# EAGLE design main (EAGLE 9.6.2)
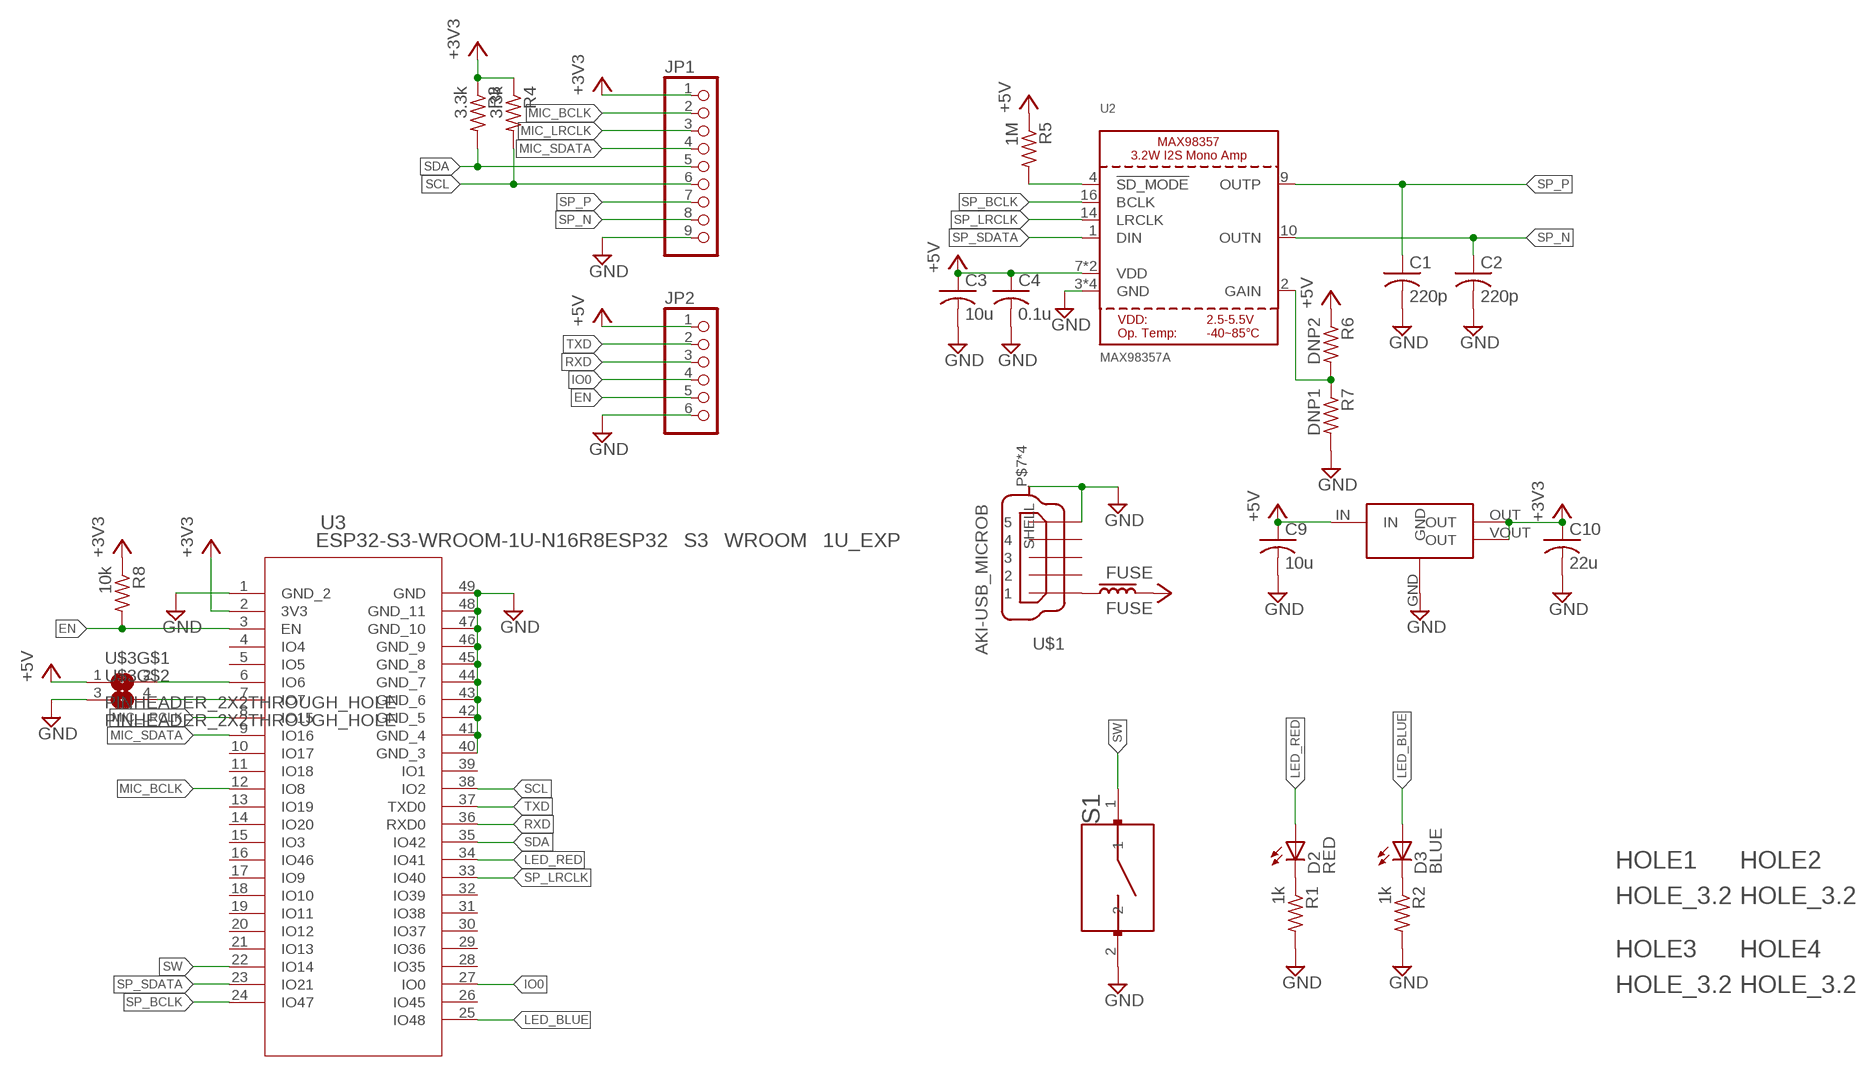
[diagram p0: schematic, sheet 1]

## Parts
C1  220p  C-2012  [2012-C]
C2  220p  C-2012  [2012-C]
C3  10u  C-2012  [2012-C]
C4  0.1u  C-2012  [2012-C]
C9  10u  C-2012  [2012-C]
C10  22u  C-2012  [2012-C]
D2  RED  LED-SMD2012  [D2012]
D3  BLUE  LED-SMD2012  [D2012]
FUSE  FUSE  FB-2012  [2012-C]
HOLE1  HOLE_3.2  [HOLE_3.2]
HOLE2  HOLE_3.2  [HOLE_3.2]
HOLE3  HOLE_3.2  [HOLE_3.2]
HOLE4  HOLE_3.2  [HOLE_3.2]
IC2  AZ1117H-ADJ  [SOT223]
JP1  PINHD-1X9  [1X09]
JP2  PINHD-1X6  [1X06]
R1  1k  R-2012  [2012-R]
R2  1k  R-2012  [2012-R]
R3  3.3k  R-2012  [2012-R]
R4  3.3k  R-2012  [2012-R]
R5  1M  R-2012  [2012-R]
R6  DNP2  R-2012  [2012-R]
R7  DNP1  R-2012  [2012-R]
R8  10k  R-2012  [2012-R]
S1  TACTSW_SMD  [SW_B3U-1000P]
U2  MAX98357A  AUDIOAMP_MAX98357  [QFN16_3MM]
U3  ESP32-S3-WROOM-1U-N16R8ESP32�S3�WROOM�1U_EXP  [ESP32�S3�WROOM�1U_EXP]
U$1  AKI-USB_MICROB  [ZX62R_B]
U$3  PINHEADER_2X2THROUGH_HOLE  [2X02]

## Nets
+3V3: C10.1 IC2.OUT IC2.VOUT(OUT) JP1.1 R3.1 R4.1 R8.1 U3.2(3V3)
+5V: C3.1 C4.1 C9.1 FUSE.2 IC2.IN JP2.1 R5.1 R6.1 U2.7(VDD) U2.8(VDD) U$3.1
EN: JP2.5 R8.2 U3.3(EN)
GND: C1.2 C2.2 C3.2 C4.2 C9.2 C10.2 IC2.GND JP1.9 JP2.6 R1.2 R2.2 R7.2 S1.2 U2.3(GND) U2.11(GND) U2.15(GND) U2.THERMAL(GND) U3.1(GND_2) U3.40(GND_3) U3.41(GND_4) U3.42(GND_5) U3.43(GND_6) U3.44(GND_7) U3.45(GND_8) U3.46(GND_9) U3.47(GND_10) U3.48(GND_11) U3.49(GND) U$1.5 U$1.P$7(SHELL) U$1.P$8(SHELL) U$1.P$9(SHELL) U$1.SH(SHELL) U$3.3
IO0: JP2.4 U3.27(IO0)
LED_BLUE: D3.A U3.25(IO48)
LED_RED: D2.A U3.34(IO41)
MIC_BCLK: JP1.2 U3.12(IO8)
MIC_LRCLK: JP1.3 U3.8(IO15)
MIC_SDATA: JP1.4 U3.9(IO16)
N$1: D3.K R2.1
N$2: FUSE.1 U$1.1
N$3: D2.K R1.1
N$4: R6.2 R7.1 U2.2(GAIN)
N$7: U3.6(IO6) U$3.2
N$9: R5.2 U2.4(!SD_MODE)
N$11: U3.7(IO7) U$3.4
RXD: JP2.3 U3.36(RXD0)
SCL: JP1.6 R4.2 U3.38(IO2)
SDA: JP1.5 R3.2 U3.35(IO42)
SP_BCLK: U2.16(BCLK) U3.24(IO47)
SP_LRCLK: U2.14(LRCLK) U3.33(IO40)
SP_N: C2.1 JP1.8 U2.10(OUTN)
SP_P: C1.1 JP1.7 U2.9(OUTP)
SP_SDATA: U2.1(DIN) U3.23(IO21)
SW: S1.1 U3.22(IO14)
TXD: JP2.2 U3.37(TXD0)
Unconnected: U3.4(IO4) U3.5(IO5) U3.10(IO17) U3.11(IO18) U3.13(IO19) U3.14(IO20) U3.15(IO3) U3.16(IO46) U3.17(IO9) U3.18(IO10) U3.19(IO11) U3.20(IO12) U3.21(IO13) U3.26(IO45) U3.28(IO35) U3.29(IO36) U3.30(IO37) U3.31(IO38) U3.32(IO39) U3.39(IO1) U$1.2 U$1.3 U$1.4

## Library data of the parts
C1-C4 C9 C10 = Passive_Robotech:C
D2 D3 = Diode_Robotech:LED
FUSE = Passive_Robotech:FB
HOLE1-HOLE4 = Document_Robotech:HOLE_3.2: Robotech hole diameter 3.2mm tDoc washer(diameter 8mm) bDoc spacer(diameter 6mm)
IC2 = IC_Robotech:AZ1117H-ADJ: VOLTAGE REGULATOR
JP1 = pinhead:PINHD-1X9: PIN HEADER
JP2 = pinhead:PINHD-1X6: PIN HEADER
R1-R8 = Passive_Robotech:R
S1 = Passive_Robotech:TACTSW_SMD: Ultra-small Surface-mounting Tactile Switches with High Contact Reliability; DESCRIPTION: Switch Tactile N.O. SPST Projected Plunger PC Pins 0.05A 24VDC 1.47N Thru-Hole Bag; DIGI-KEY_PART_NUMBER: SW1021CT-ND; DIGI-KEY_PURCHASE_URL: https://www.digikey.jp/product-detail/en/omron-electronics-inc-emc-div/B3U-1100P/SW1021CT-ND/1534358?utm_source=snapeda&utm_medium=aggregator&utm_campaign=symbol; MF: Omron; MP: B3U-1100P; PACKAGE: None
U2 = microbuilder:AUDIOAMP_MAX98357: MAX98357 - 3.2W I2S Mono Audio Amp
U3 = 2023-11-13_09-10-41_Library:ESP32-S3-WROOM-1U-N16R8; COPYRIGHT: Copyright (C) 2023 Ultra Librarian. All rights reserved.; MANUFACTURER_PART_NUMBER: ESP32-S3-WROOM-1U-N16R8; MFR_NAME: Espressif Systems
U$1 = Connector_Robotech:AKI-USB_MICROB: @秋月 表面実装用ＵＳＢコネクタ・マイクロＢ（ｍｉｃｒｏＢ）（５個入） [ZX62R-B-5P] 通販コード C-05254
U$3 = Connector_Robotech:PINHEADER_2X2

## Board
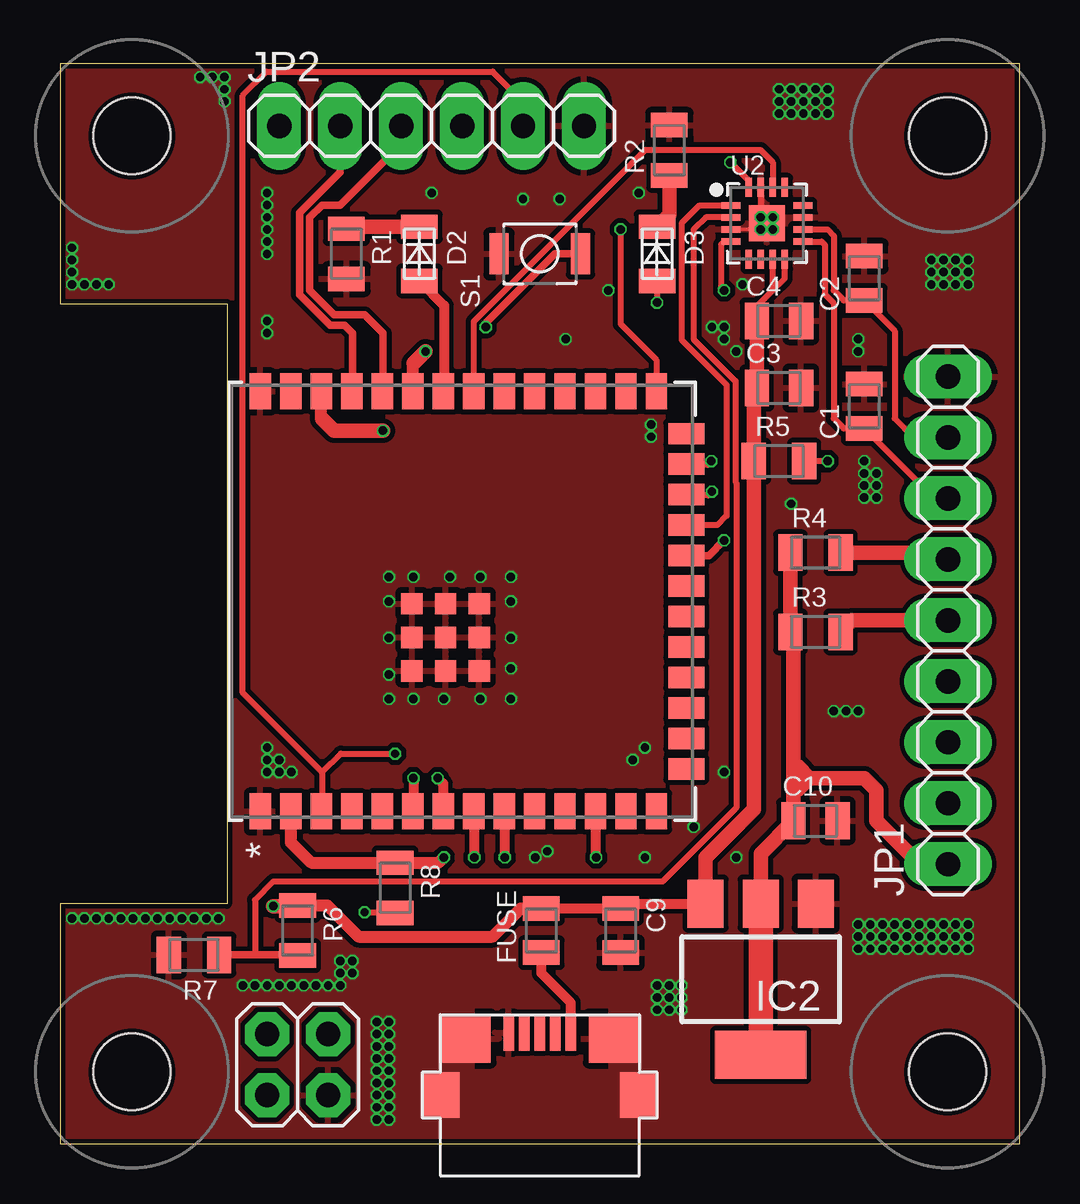
[diagram p1: board, top side]
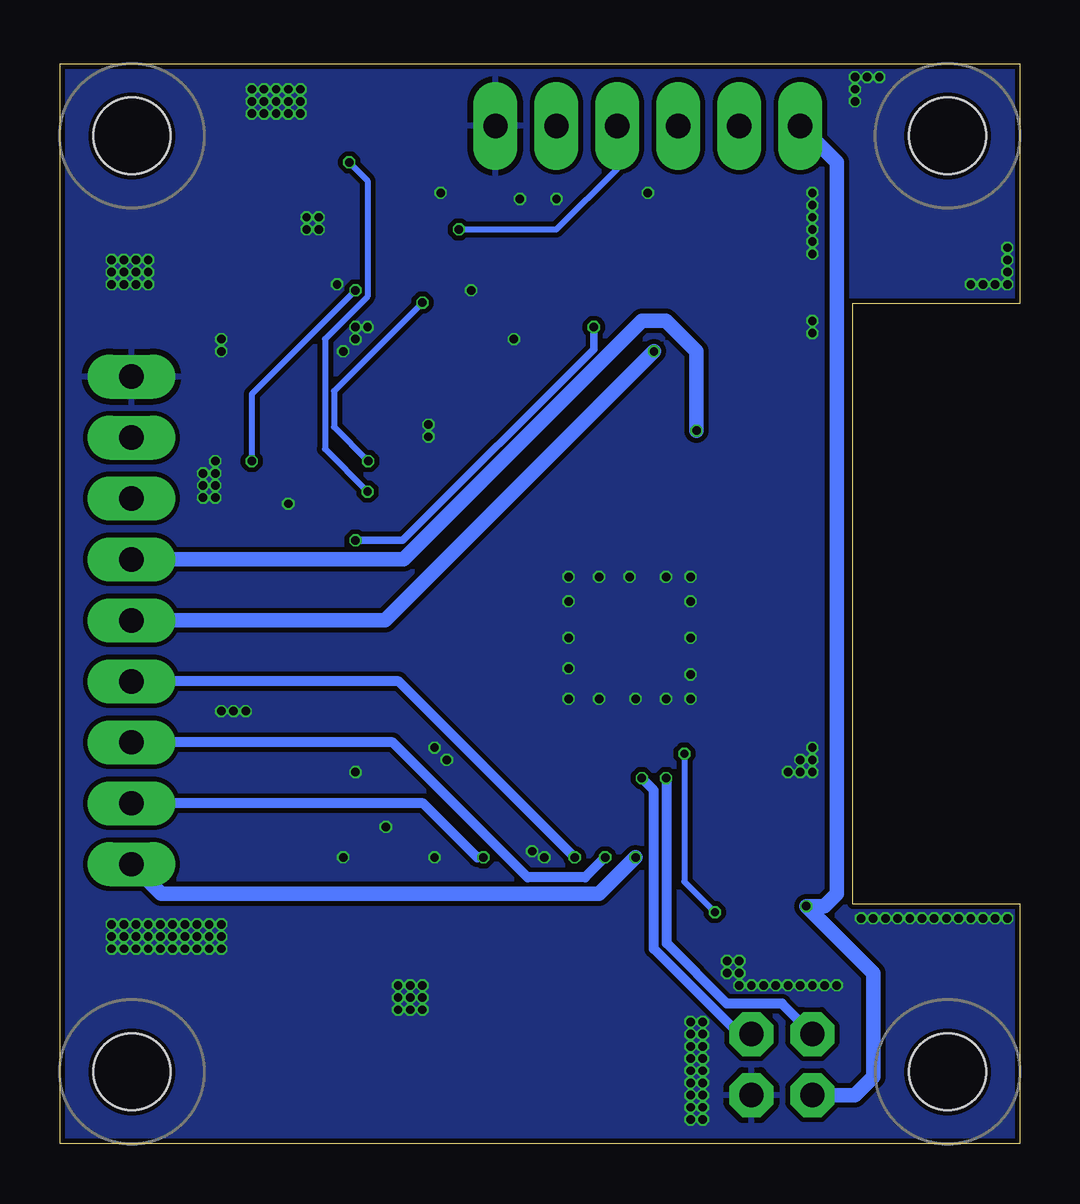
[diagram p2: board, bottom side, seen from below]

Size 40 x 45 mm. Coordinates in mm from the lower left corner, seen from the top.
Outline: 0,0 40,0 40,45 0,45 0,35 6.97,35 6.97,10 0,10 0,0
Copper layers (1*16): Top 0.035mm / dielectric 1.6mm / Bottom 0.035mm
Design rules "jlcpcb-2layers": minimum track width 5mil, minimum drill 0.3mm, track to track 5mil, track to pad 5mil, pad to pad 5mil, via to via 5mil, smd to smd 0mil, copper to edge 0.2mm, drill to drill 6mil, minimum pad ring 10mil, minimum via ring 3mil, stop-mask expansion 4mil, vias tented up to drill 0.5mm, thermal gap 10mil

### Footprints (pad centres in the part's own frame; a part is rotated, then mirrored left to right if it is on the bottom)
2012-C = smd 1.016 x 1.524: 1 -0.921,0; 2 0.921,0
D2012 = smd 1.016 x 1.524: A 1.127,0; K -1.127,0
HOLE_3.2 = hole 3.2: 0,0
SOT223 = smd 1.5 x 2: GND -2.3,-3.15; IN 2.3,-3.15; OUT 0,-3.15 | smd 3.8 x 2: VOUT 0,3.15
1X09 = drill 1.016 long: 1 -10.16,0; 2 -7.62,0; 3 -5.08,0; 4 -2.54,0; 5 0,0; 6 2.54,0; 7 5.08,0; 8 7.62,0; 9 10.16,0
1X06 = drill 1.016 long: 1 -6.35,0; 2 -3.81,0; 3 -1.27,0; 4 1.27,0; 5 3.81,0; 6 6.35,0
2012-R = smd 1.016 x 1.524: 1 -1.048,0; 2 1.048,0
SW_B3U-1000P = smd 0.8 x 1.7: 1 1.7,0; 2 -1.7,0
QFN16_3MM = smd 0.8 x 0.28: 1 -1.5,0.75; 2 -1.5,0.25; 3 -1.5,-0.25; 4 -1.5,-0.75; 9 1.5,-0.75; 10 1.5,-0.25; 11 1.5,0.25; 12 1.5,0.75 | smd 0.28 x 0.8: 5 -0.75,-1.5; 6 -0.25,-1.5; 7 0.25,-1.5; 8 0.75,-1.5; 13 0.75,1.5; 14 0.25,1.5; 15 -0.25,1.5; 16 -0.75,1.5 | smd 1.5 x 1.5: THERMAL 0,0
ESP32�S3�WROOM�1U_EXP = smd 1.499 x 0.889: 1 -8.75,8.41; 2 -8.75,7.14; 3 -8.75,5.87; 4 -8.75,4.6; 5 -8.75,3.33; 6 -8.75,2.06; 7 -8.75,0.79; 8 -8.75,-0.48; 9 -8.75,-1.75; 10 -8.75,-3.02; 11 -8.75,-4.29; 12 -8.75,-5.56; 13 -8.75,-6.83; 14 -8.75,-8.1; 27 8.75,-8.1; 28 8.75,-6.83; 29 8.75,-5.56; 30 8.75,-4.29; 31 8.75,-3.02; 32 8.75,-1.75; 33 8.75,-0.48; 34 8.75,0.79; 35 8.75,2.06; 36 8.75,3.33; 37 8.75,4.6; 38 8.75,5.87; 39 8.75,7.14; 40 8.75,8.41 | smd 0.889 x 1.499: 15 -6.985,-9.35; 16 -5.715,-9.35; 17 -4.445,-9.35; 18 -3.175,-9.35; 19 -1.905,-9.35; 20 -0.635,-9.35; 21 0.635,-9.35; 22 1.905,-9.35; 23 3.175,-9.35; 24 4.445,-9.35; 25 5.715,-9.35; 26 6.985,-9.35 | smd 0.889 x 0.889: 41 -1.501,0.691; 42 -1.501,2.09; 43 -2.901,2.09; 44 -2.901,0.691; 45 -2.901,-0.709; 46 -1.501,-0.709; 47 -0.102,-0.709; 48 -0.102,0.691; 49 -0.102,2.09
ZX62R_B = smd 0.44 x 1.5: 1 1.3,2.6; 2 0.65,2.6; 3 0,2.6; 4 -0.65,2.6; 5 -1.3,2.6 | smd 1.6 x 1.9: P$7 4.15,0; SH -4.15,0 | smd 2.1 x 2: P$8 -3.1,2.35; P$9 3.1,2.35
2X02 = drill 1.016 octagon: 1 -1.27,-1.27; 2 -1.27,1.27; 3 1.27,-1.27; 4 1.27,1.27

### Placement (x,y rotation side)
C1  33.53,30.73 90 top
C2  33.53,36.07 90 top
C3  29.97,31.5 0 top
C4  29.97,34.29 0 top
C9  23.37,8.89 270 top
C10  31.5,13.46 0 top
D2  14.99,37.08 270 top
D3  24.89,37.08 270 top
FUSE  20.07,8.89 90 top
HOLE1  3,3 0 top
HOLE2  37,3 0 top
HOLE3  37,42 0 top
HOLE4  3,42 0 top
IC2  29.21,6.86 180 top
JP1  37.02,21.81 90 top
JP2  15.49,42.42 0 top
R1  11.94,37.08 270 top
R2  25.4,41.4 90 top
R3  31.5,21.34 0 top
R4  31.5,24.64 0 top
R5  29.97,28.45 0 top
R6  9.91,8.89 270 top
R7  5.59,7.87 180 top
R8  13.97,10.67 270 top
S1  20,37.08 0 top
U2  29.46,38.35 0 top
U3  16.76,22.61 90 top
U$1  20,2.03 0 top
U$3  9.91,3.3 0 top

### Tracks (layer width: path | path; a pad name or v marks a point on that pad's centre or on a via)
+3V3  (via drill 0.35)
  Top 0.508: U3.2 9.62,12.56 10.47,11.72 R8.1 15.78,11.72 v16,11.94
  Top 0.61: IC2.OUT 29.21,12.1 C10.1 30.57,14.73 | JP1.1 35.85,11.65 34.04,13.46 34.04,14.73 33.53,15.24 31.24,15.24 | 30.57,14.73 30.57,15.24 | 30.57,15.24 30.57,15.75 | 30.57,15.75 30.57,21.21 R3.1 R4.1 | 30.57,15.24 31.24,15.24 | 31.24,15.24 30.73,15.75 30.57,15.75 | 31.24,15.24 30.73,14.73 30.57,14.73
  Top 1.016: IC2.VOUT IC2.OUT
  Bottom 0.61: JP1.1 35.78,10.41 17.53,10.41 v16,11.94
+5V  (via drill 0.35)
  Top 0.254: C4.1 29.05,34.89 29.72,35.56 | 29.72,35.56 U2.7 | 29.72,35.56 30.21,36.06 U2.8
  Top 0.406: FUSE.2 | FUSE.2 C9.1 23.57,10.01 IC2.IN
  Top 0.508: R6.1 11.14,9.94 12.45,8.64 18.03,8.64 19.21,9.81 FUSE.2
  Top 0.61: IC2.IN 26.91,11.92 28.92,13.94 R5.1 28.92,31.37 C3.1 C4.1 | R6.1 9.94,9.91 v8.89,9.91
  Bottom 0.61: JP2.1 7.62,40.89 7.62,10.41 8.13,9.91 v8.89,9.91 6.1,7.11 6.1,2.79 6.86,2.03 U$3.1
EN  (via drill 0.35)
  Top 0.254: 10.94,15.48 7.62,18.8 7.62,43.69 8.61,44.67 18.03,44.67 19.3,43.4 JP2.5 | 10.94,15.48 10.94,13.9 U3.3 | 10.94,15.48 11.71,16.26 v13.97,16.26 | v12.7,9.65 13.94,9.65 R8.2
  Bottom 0.254: v13.97,16.26 13.97,10.92 v12.7,9.65
GND  (via drill 0.35)
  Top 0.152: U2.3 v29.21,38.1
  Top 0.254: U2.15 v29.21,38.61
  other vias: 24.13,39.62 22.86,35.56 20.83,39.37 19.3,39.37 15.49,39.62 21.08,33.53 8.64,39.62 8.64,39.12 8.64,38.61 8.64,38.1 8.64,37.59 8.64,37.08 29.72,38.1 29.72,38.61 28.45,35.81 27.18,34.04 27.69,34.04 27.69,33.53 28.19,33.02 0.51,37.34 0.51,36.83 0.51,36.32 0.51,35.81 1.02,35.81 1.52,35.81 2.03,35.81 5.84,44.45 6.35,44.45 6.86,44.45 6.86,43.94 6.86,43.43 13.72,5.08 13.72,4.57 13.72,4.06 13.72,3.56 13.72,3.05 13.72,2.54 13.72,2.03 13.72,1.52 13.72,1.02 13.21,5.08 13.21,4.57 13.21,4.06 13.21,3.56 13.21,3.05 13.21,2.54 13.21,2.03 13.21,1.52 13.21,1.02 0.51,9.4 1.02,9.4 1.52,9.4 2.03,9.4 2.54,9.4 3.05,9.4 3.56,9.4 4.06,9.4 4.57,9.4 5.08,9.4 5.59,9.4 6.1,9.4 6.6,9.4 33.27,9.14 33.27,8.64 33.27,8.13 33.78,9.14 34.29,9.14 34.8,9.14 35.31,9.14 35.81,9.14 36.32,9.14 36.83,9.14 37.34,9.14 37.85,9.14 33.78,8.64 34.29,8.64 34.8,8.64 35.31,8.64 35.81,8.64 36.32,8.64 36.83,8.64 37.34,8.64 37.85,8.64 33.78,8.13 34.29,8.13 34.8,8.13 35.31,8.13 35.81,8.13 36.32,8.13 36.83,8.13 37.34,8.13 37.85,8.13 13.72,22.61 13.72,21.08 13.72,19.56 14.73,18.54 16,18.54 17.53,18.54 18.8,19.81 18.8,21.08 18.8,22.61 17.53,23.62 16.26,23.62 14.73,23.62 13.72,23.62 13.72,18.54 18.8,18.54 18.8,23.62 8.64,33.78 8.64,34.29 26.42,13.21 27.69,15.49 24.38,11.94 33.27,33.53 33.27,33.02 29.97,43.94 30.48,43.94 30.99,43.94 31.5,43.94 32,43.94 29.97,43.43 30.48,43.43 30.99,43.43 31.5,43.43 32,43.43 29.97,42.93 30.48,42.93 30.99,42.93 31.5,42.93 32,42.93 36.32,36.83 36.83,36.83 37.34,36.83 37.85,36.83 36.32,36.32 36.83,36.32 37.34,36.32 37.85,36.32 36.32,35.81 36.83,35.81 37.34,35.81 37.85,35.81 33.53,28.45 33.53,27.94 33.53,27.43 34.04,27.43 34.04,27.94 33.53,26.92 34.04,26.92 30.48,26.67 28.19,11.94 24.89,6.6 24.89,6.1 24.89,5.59 25.4,5.59 25.4,6.1 25.4,6.6 25.91,6.6 25.91,6.1 25.91,5.59 8.64,16.51 8.64,16 9.14,16 8.64,15.49 9.14,15.49 9.65,15.49 32.26,18.03 32.77,18.03 33.27,18.03 24.38,16.51 24.64,29.46 24.64,29.97 23.88,16 19.81,11.94 20.32,12.19 7.62,6.6 8.13,6.6 8.64,6.6 9.14,6.6 9.65,6.6 10.16,6.6 10.67,6.6 11.18,6.6 11.68,6.6 11.68,7.11 12.19,7.11 11.68,7.62 12.19,7.62
  pour Bottom (isolate 0.203): 0,44.96 0,34.8 6.86,34.8 6.86,10.16 0,10.16 0,0 40.13,0 40.13,45.21 0,45.21
  pour Top (isolate 0.203): 0,44.96 0,34.8 6.86,34.8 6.86,10.16 0,10.16 0,0 40.13,0 40.13,45.21 0,45.21
  pour Top (no thermals): 14.48,6.1 14.48,0.51 17.27,0.51 17.27,6.1
  pour Top (no thermals): 22.86,6.1 22.86,0.51 25.4,0.51 25.4,6.1
IO0  (via drill 0.35)
  Top 0.254: v23.37,38.1 23.37,34.17 24.86,32.67 U3.27
  Bottom 0.254: JP2.4 16.76,40.64 19.3,38.1 v23.37,38.1
LED_BLUE  (via drill 0.35)
  Top 0.254: D3.A v24.89,35.05 | v27.15,28.45 26.99,28.29 26.15,28.29 U3.25
  Bottom 0.254: v24.89,35.05 28.57,31.37 28.57,29.87 v27.15,28.45
LED_RED
  Top 0.406: D2.A 16.02,34.93 16.02,31.4 U3.34
MIC_BCLK  (via drill 0.35)
  Top 0.406: U3.12 22.35,13.83 v22.35,11.94
  Bottom 0.406: v22.35,11.94 22.61,11.94 24.86,14.19 JP1.2
MIC_LRCLK  (via drill 0.35)
  Top 0.406: U3.8 17.27,13.83 v17.27,11.94
  Bottom 0.406: JP1.3 26.13,16.73 20.5,11.1 18.11,11.1 v17.27,11.94
MIC_SDATA  (via drill 0.35)
  Top 0.406: U3.9 18.54,13.83 v18.54,11.94
  Bottom 0.406: v18.54,11.94 25.88,19.27 JP1.4
N$1
  Top 0.61: R2.1 25.4,38.72 D3.K
N$2
  Top 0.406: U$1.1 21.3,5.88 20.07,7.11 FUSE.1
N$3
  Top 0.61: R1.1 12.02,38.21 D2.K
N$4
  Top 0.254: U2.2 26.92,38.6 26.42,38.1 26.42,33.53 28.16,31.78 28.16,27.58 28.19,27.55 28.19,14 25.12,10.92 8.89,10.92 8.13,10.16 8.13,7.87
  Top 0.305: R7.1 8.13,7.87 9.87,7.87 R6.2
N$7  (via drill 0.35)
  Top 0.406: v14.73,15.24 14.73,13.88 U3.6
  Bottom 0.406: U$3.2 9.91,5.84 12.2,5.84 14.71,8.35 14.71,15.21 v14.73,15.24
N$9  (via drill 0.35)
  Top 0.254: U2.4 27.69,37.59 27.56,37.47 27.56,35.69 v27.69,35.56 | v32,28.45 R5.2
  Bottom 0.254: v27.69,35.56 32,31.24 v32,28.45
N$11  (via drill 0.35)
  Top 0.406: v15.75,15.24 15.97,15.01 U3.7
  Bottom 0.406: U$3.4 11.68,4.57 15.24,8.13 15.24,14.73 v15.75,15.24
RXD
  Top 0.305: JP2.3 14.22,41.66 11.68,39.12 10.92,39.12 10.41,38.61 10.41,35.56 11.43,34.54 12.7,34.54 13.48,33.77 13.48,31.4 U3.36
SCL  (via drill 0.35)
  Top 0.508: 10.94,30.21 10.89,30.25 U3.38
  Top 0.61: R4.2 36.73,24.64 JP1.6 | 10.94,30.21 11.43,29.72 v13.46,29.72
  Bottom 0.61: JP1.6 25.69,24.35 15.75,34.29 14.73,34.29 13.46,33.02 v13.46,29.72
SDA  (via drill 0.35)
  Top 0.508: 14.75,32.53 14.7,32.48 U3.35
  Top 0.61: R3.2 33.02,21.81 JP1.5 | v15.24,33.02 14.75,32.53
  Bottom 0.61: v15.24,33.02 26.45,21.81 JP1.5
SP_BCLK  (via drill 0.35)
  Top 0.254: U2.16 28.71,40.12 v27.94,40.89 | v27.18,27.18 27.02,27.02 26.15,27.02 U3.24
  Bottom 0.254: v27.94,40.89 27.18,40.13 27.18,35.31 28.96,33.53 28.96,28.96 v27.18,27.18
SP_LRCLK
  Top 0.254: U2.14 29.71,40.9 29.21,41.4 24.38,41.4 17.24,34.26 U3.33
SP_N
  Top 0.254: U2.10 32,38.1 32.26,37.85 32.26,35.56 32.67,35.15 C2.1 34.8,33.88 34.8,30.23 35.59,29.43 JP1.8
SP_P
  Top 0.254: U2.9 30.98,37.59 31.75,37.59 31.88,37.47 31.88,35.4 32.26,35.02 32.26,30.23 32.67,29.81 C1.1 36.45,26.89 JP1.7
SP_SDATA
  Top 0.254: U2.1 26.66,39.1 25.91,38.35 25.91,33.5 27.78,31.62 27.78,26.16 27.4,25.78 U3.23
SW  (via drill 0.35)
  Top 0.305: S1.1 20.64,37.08 17.75,34.19 v17.75,34.04 | v27.69,25.15 27.05,24.51 U3.22
  Bottom 0.305: v17.75,34.04 17.75,33.12 25.72,25.15 v27.69,25.15
TXD
  Top 0.305: JP2.2 11.68,40.49 9.98,38.79 9.98,35.38 11.25,34.11 11.86,34.11 12.19,33.78 12.19,31.38 U3.37

### Text on the board
bValues: HotBath v1.1 | Designed by Hamataku Lab 2023